# Altium schematic sheet P03_Connectors.SchDoc
size A4; SheetNumber: 3; SheetTotal: 3
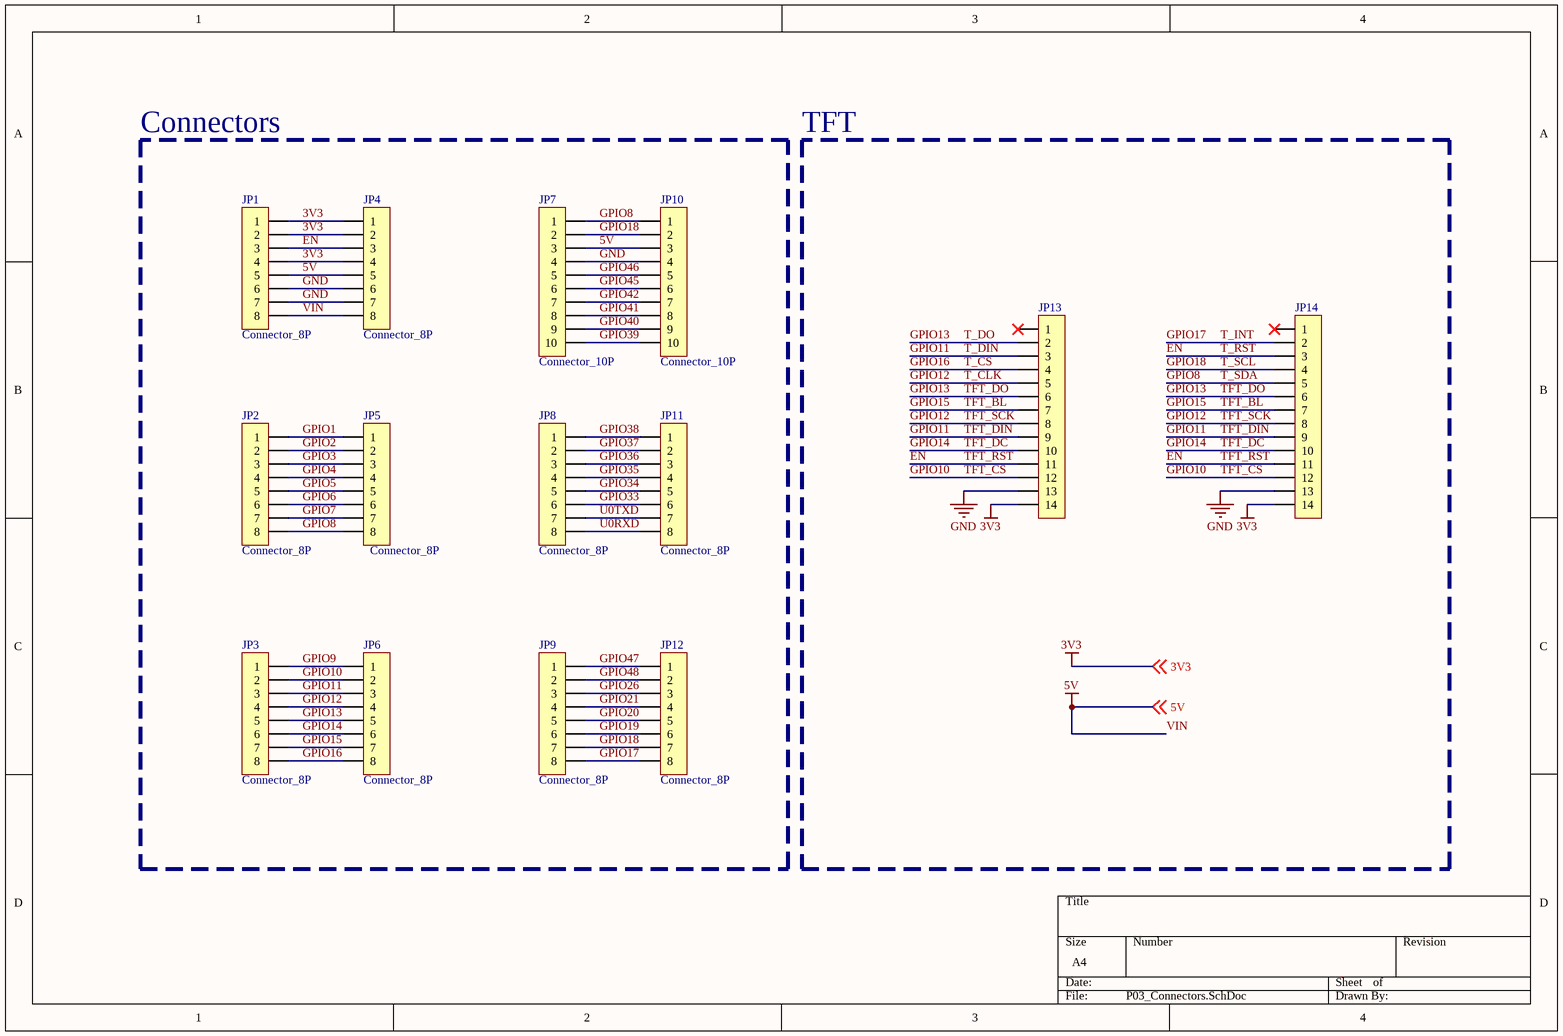
[diagram p0: P03_Connectors.SchDoc]

## Parts
JP1  Connector_8P  [排母_2.54mm_8P]
JP2  Connector_8P  [排母_2.54mm_8P]
JP3  Connector_8P  [排母_2.54mm_8P]
JP4  Connector_8P  [排针_2.54mm_8P]
JP5  Connector_8P  [排针_2.54mm_8P]
JP6  Connector_8P  [排针_2.54mm_8P]
JP7  Connector_10P  [排母_2.54mm_10P]
JP8  Connector_8P  [排母_2.54mm_8P]
JP9  Connector_8P  [排母_2.54mm_8P]
JP10  Connector_10P  [排针_2.54mm_10P]
JP11  Connector_8P  [排针_2.54mm_8P]
JP12  Connector_8P  [排针_2.54mm_8P]
JP13  HDR-1X14  [HDR2.54-M-LI-14P]  (value not drawn)
JP14  HDR-1X14  [HDR2.54-M-LI-14P]  (value not drawn)

## Blocks framed on the sheet
Connectors: JP1-JP12
TFT: JP13 JP14

## Nets
3V3: JP1.1 JP1.2 JP1.4 JP4.1 JP4.2 JP4.4 JP13.14 JP14.14 ; off-sheet 3V3
5V: JP1.5 JP1.8 JP4.5 JP4.8 JP7.3 JP10.3 ; off-sheet 5V  [also labelled VIN]
GND: JP1.6 JP1.7 JP4.6 JP4.7 JP7.4 JP10.4 JP13.13 JP14.13
EN: JP1.3 JP4.3 JP13.11 JP14.3 JP14.11  [also labelled T_RST, TFT_RST]
GPIO1: JP2.1 JP5.1
GPIO2: JP2.2 JP5.2
GPIO3: JP2.3 JP5.3
GPIO4: JP2.4 JP5.4
GPIO5: JP2.5 JP5.5
GPIO6: JP2.6 JP5.6
GPIO7: JP2.7 JP5.7
GPIO8: JP2.8 JP5.8 JP7.1 JP10.1 JP14.5  [also labelled T_SDA]
GPIO9: JP3.1 JP6.1
GPIO10: JP3.2 JP6.2 JP13.12 JP14.12  [also labelled TFT_CS]
GPIO11: JP3.3 JP6.3 JP13.3 JP13.9 JP14.9  [also labelled T_DIN, TFT_DIN]
GPIO12: JP3.4 JP6.4 JP13.5 JP13.8 JP14.8  [also labelled T_CLK, TFT_SCK]
GPIO13: JP3.5 JP6.5 JP13.2 JP13.6 JP14.6  [also labelled T_DO, TFT_DO]
GPIO14: JP3.6 JP6.6 JP13.10 JP14.10  [also labelled TFT_DC]
GPIO15: JP3.7 JP6.7 JP13.7 JP14.7  [also labelled TFT_BL]
GPIO16: JP3.8 JP6.8 JP13.4  [also labelled T_CS]
GPIO17: JP9.8 JP12.8 JP14.2  [also labelled T_INT]
GPIO18: JP7.2 JP9.7 JP10.2 JP12.7 JP14.4  [also labelled T_SCL]
GPIO19: JP9.6 JP12.6
GPIO20: JP9.5 JP12.5
GPIO21: JP9.4 JP12.4
GPIO26: JP9.3 JP12.3
GPIO33: JP8.6 JP11.6
GPIO34: JP8.5 JP11.5
GPIO35: JP8.4 JP11.4
GPIO36: JP8.3 JP11.3
GPIO37: JP8.2 JP11.2
GPIO38: JP8.1 JP11.1
GPIO39: JP7.10 JP10.10
GPIO40: JP7.9 JP10.9
GPIO41: JP7.8 JP10.8
GPIO42: JP7.7 JP10.7
GPIO45: JP7.6 JP10.6
GPIO46: JP7.5 JP10.5
GPIO47: JP9.1 JP12.1
GPIO48: JP9.2 JP12.2
U0RXD: JP8.8 JP11.8
U0TXD: JP8.7 JP11.7

Not connected (* = marked no-connect by the designer): JP13 1*; JP14 1*

## Library data of the parts
JP13 JP14 = Header 14: 14P接插件